# Altium schematic sheet 13_Clocks_1.SchDoc: Clocks 1
size A3; Organization: Lime Microsystems; Address1: Surrey Tech Centre; Address2: Guildford GU2 7YG; Address3: Surrey; Address4: United Kingdom; Revision: SoDeRa-PCI v1.0; SheetNumber: 13; SheetTotal: 15
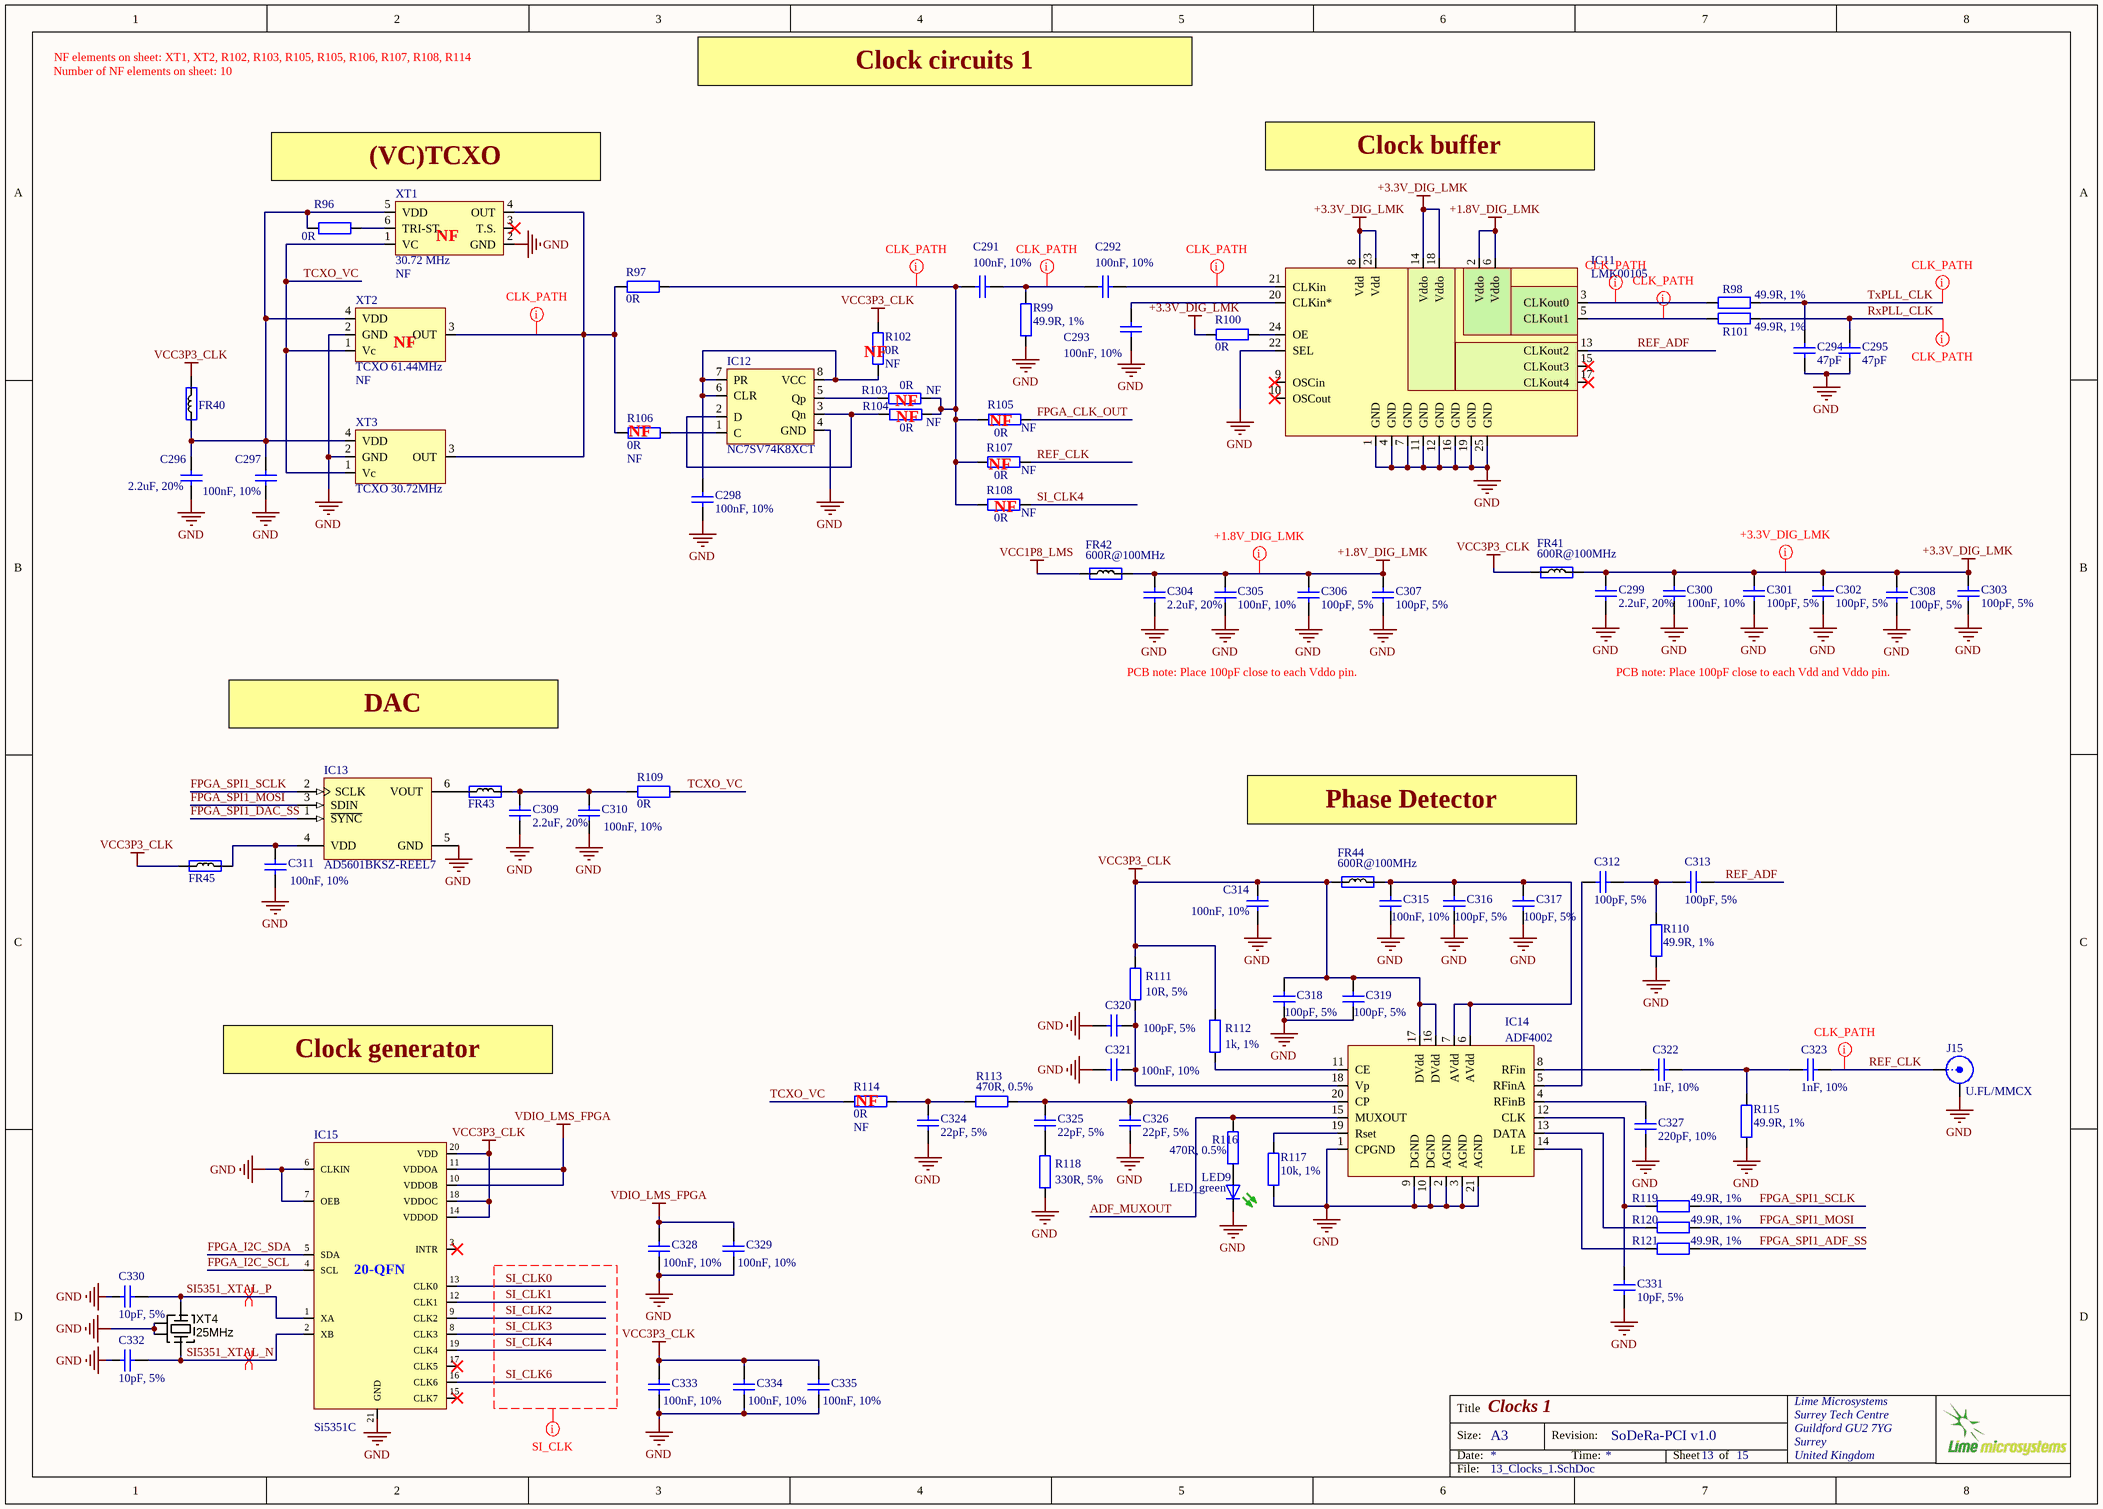
[diagram p0: 13_Clocks_1.SchDoc]

## Parts
C291  100nF, 10%  [CAP0402]
C292  100nF, 10%  [CAP0402]
C293  100nF, 10%  [CAP0402]
C294  47pF  [CAP0402]
C295  47pF  [CAP0402]
C296  2.2uF, 20%  [CAP0402]
C297  100nF, 10%  [CAP0402]
C298  100nF, 10%  [CAP0402]
C299  2.2uF, 20%  [CAP0402]
C300  100nF, 10%  [CAP0402]
C301  100pF, 5%  [CAP0402]
C302  100pF, 5%  [CAP0402]
C303  100pF, 5%  [CAP0402]
C304  2.2uF, 20%  [CAP0402]
C305  100nF, 10%  [CAP0402]
C306  100pF, 5%  [CAP0402]
C307  100pF, 5%  [CAP0402]
C308  100pF, 5%  [CAP0402]
C309  2.2uF, 20%  [CAP0402]
C310  100nF, 10%  [CAP0402]
C311  100nF, 10%  [CAP0402]
C312  100pF, 5%  [CAP0402]
C313  100pF, 5%  [CAP0402]
C314  100nF, 10%  [CAP0402]
C315  100nF, 10%  [CAP0402]
C316  100pF, 5%  [CAP0402]
C317  100pF, 5%  [CAP0402]
C318  100pF, 5%  [CAP0402]
C319  100pF, 5%  [CAP0402]
C320  100pF, 5%  [CAP0402]
C321  100nF, 10%  [CAP0402]
C322  1nF, 10%  [CAP0402]
C323  1nF, 10%  [CAP0402]
C324  22pF, 5%  [CAP0402]
C325  22pF, 5%  [CAP0402]
C326  22pF, 5%  [CAP0402]
C327  220pF, 10%  [CAP0402]
C328  100nF, 10%  [CAP0402]
C329  100nF, 10%  [CAP0402]
C330  10pF, 5%  [CAP0402]
C331  10pF, 5%  [CAP0402]
C332  10pF, 5%  [CAP0402]
C333  100nF, 10%  [CAP0402]
C334  100nF, 10%  [CAP0402]
C335  100nF, 10%  [CAP0402]
FR40  Ferrite  [RES0201]  (value not drawn)
FR41  600R@100MHz  [RES0805]
FR42  600R@100MHz  [RES0805]
FR43  Ferrite  [RES0201]  (value not drawn)
FR44  600R@100MHz  [RES0805]
FR45  Ferrite  [RES0201]  (value not drawn)
IC11  LMK00105  [LMK00105SQ]
IC12  NC7SV74K8XCT  [NC7SV74K8XCT]
IC13  AD5601BKSZ-REEL7  [AD5601_SOT23-6]
IC14  ADF4002  [ADF4002]
IC15  Si5351C  [Si5351C_20QFN]
J15  U.FL/MMCX  [MMCX_UFL_conn_u]
LED9  LED_green  [LED-0603-GREEN]
R96  0R  [RES0402]
R97  0R  [RES0402]
R98  49.9R, 1%  [RES0402]
R99  49.9R, 1%  [RES0402]
R100  0R  [RES0402]
R101  49.9R, 1%  [RES0402]
R102  0R  Assembly Info: NF  [RES0402]
R103  0R  Assembly Info: NF  [RES0402]
R104  0R  Assembly Info: NF  [RES0402]
R105  0R  Assembly Info: NF  [RES0402]
R106  0R  Assembly Info: NF  [RES0402]
R107  0R  Assembly Info: NF  [RES0402]
R108  0R  Assembly Info: NF  [RES0402]
R109  0R  [RES0402]
R110  49.9R, 1%  [RES0402]
R111  10R, 5%  [RES0402]
R112  1k, 1%  [RES0402]
R113  470R, 0.5%  [RES0402]
R114  0R  Assembly Info: NF  [RES0402]
R115  49.9R, 1%  [RES0402]
R116  470R, 0.5%  [RES0402]
R117  10k, 1%  [RES0402]
R118  330R, 5%  [RES0402]
R119  49.9R, 1%  [RES0402]
R120  49.9R, 1%  [RES0402]
R121  49.9R, 1%  [RES0402]
XT1  30.72 MHz  Assembly Info: NF  [RAKON_RPT7050A]
XT2  TCXO 61.44MHz  Assembly Info: NF  [RAKON_TXCO_61MHz_v2]
XT3  TCXO 30.72MHz  [RAKON_TXCO]
XT4  25MHz  [CRYSTAL_4-LCC]

## Nets
+1.8V_DIG_LMK: C304.2 C305.2 C306.2 C307.2 FR42.2 IC11.2(Vddo) IC11.6(Vddo)
+3.3V_DIG_LMK: C299.2 C300.2 C301.2 C302.2 C303.2 C308.2 FR41.2 IC11.8(Vdd) IC11.14(Vddo) IC11.18(Vddo) IC11.23(Vdd) R100.1
GND: C293.1 C294.1 C295.1 C296.1 C297.1 C298.1 C299.1 C300.1 C301.1 C302.1 C303.1 C304.1 C305.1 C306.1 C307.1 C308.1 C309.1 C310.2 C311.2 C314.1 C315.1 C316.2 C317.2 C318.2 C319.2 C320.1 C321.2 C324.1 C326.1 C327.2 C328.2 C329.2 C330.1 C331.1 C332.1 C333.2 C334.2 C335.2 IC11.1(GND) IC11.4(GND) IC11.7(GND) IC11.11(GND) IC11.12(GND) IC11.16(GND) IC11.19(GND) IC11.22(SEL) IC11.25(GND) IC12.4(GND) IC13.5(GND) IC14.1(CPGND) IC14.2(AGND) IC14.3(AGND) IC14.9(DGND) IC14.10(DGND) IC14.21(AGND) IC15.6(CLKIN) IC15.7(OEB) IC15.21(GND) J15.2(Y) LED9.K(C) R99.1 R110.1 R115.1 R117.2 R118.1 XT1.2(GND) XT2.2(GND) XT3.2(GND) XT4.2(GND) XT4.4(GND)
VCC1P8_LMS: FR42.1
VCC3P3_CLK: C314.2 C318.1 C319.1 C333.1 C334.1 C335.1 FR40.2 FR41.1 FR44.1 FR45.1 IC14.16(DVdd) IC14.17(DVdd) IC15.14(VDDOD) IC15.18(VDDOC) IC15.20(VDD) R102.1 R111.2 R112.2
VDIO_LMS_FPGA: C328.1 C329.1 IC15.10(VDDOB) IC15.11(VDDOA)
ADF_MUXOUT: IC14.15(MUXOUT) R116.2
FPGA_CLK_OUT: R105.1
FPGA_I2C_SCL: IC15.4(SCL)
FPGA_I2C_SDA: IC15.5(SDA)
FPGA_SPI1_ADF_SS: R121.1
FPGA_SPI1_DAC_SS: IC13.1(~{SYNC})
FPGA_SPI1_MOSI: IC13.3(SDIN) R120.1
FPGA_SPI1_SCLK: IC13.2(SCLK) R119.1
REF_ADF: C313.2 IC11.13(CLKout2)
REF_CLK: C323.1 J15.1(X) R107.2
RxPLL_CLK: C295.2 R101.1
SI5351_XTAL_N: C332.2 IC15.2(XB) XT4.3(X)
SI5351_XTAL_P: C330.2 IC15.1(XA) XT4.1(X)
SI_CLK0: IC15.13(CLK0)
SI_CLK1: IC15.12(CLK1)
SI_CLK2: IC15.9(CLK2)
SI_CLK3: IC15.8(CLK3)
SI_CLK4: IC15.19(CLK4) R108.2
SI_CLK6: IC15.16(CLK6)
TCXO_VC: R109.1 R114.2 XT1.1(VC) XT2.1(Vc) XT3.1(Vc)
TxPLL_CLK: C294.2 R98.1
NetC291_1: C291.1 C292.2 R99.2
NetC291_2: C291.2 R97.1 R103.1 R104.1 R105.2 R107.1 R108.1
NetC292_1: C292.1 IC11.21(CLKin)
NetC293_2: C293.2 IC11.20(CLKin*)
NetC296_2: C296.2 C297.2 FR40.1 R96.2 XT1.5(VDD) XT2.4(VDD) XT3.4(VDD)
NetC298_2: C298.2 IC12.6(CLR) IC12.7(PR) IC12.8(VCC) R102.2
NetC309_2: C309.2 C310.1 FR43.2 R109.2
NetC311_1: C311.1 FR45.2 IC13.4(VDD)
NetC312_1: C312.1 IC14.5(RFinA)
NetC312_2: C312.2 C313.1 R110.2
NetC315_2: C315.2 C316.1 C317.1 FR44.2 IC14.6(AVdd) IC14.7(AVdd)
NetC320_2: C320.2 C321.1 IC14.18(Vp) R111.1
NetC322_1: C322.1 C323.2 R115.2
NetC322_2: C322.2 IC14.8(RFin)
NetC324_2: C324.2 R113.2 R114.1
NetC325_1: C325.1 R118.2
NetC325_2: C325.2 C326.2 IC14.20(CP) R113.1
NetC327_1: C327.1 IC14.4(RFinB)
NetC331_2: C331.2 IC14.12(CLK) R119.2
NetFR43_1: FR43.1 IC13.6(VOUT)
NetIC11_3: IC11.3(CLKout0) R98.2
NetIC11_5: IC11.5(CLKout1) R101.2
NetIC11_24: IC11.24(OE) R100.2
NetIC12_1: IC12.1(C) R106.1
NetIC12_2: IC12.2(D) IC12.3(Qn) R104.2
NetIC12_5: IC12.5(Qp) R103.2
NetIC14_11: IC14.11(CE) R112.1
NetIC14_13: IC14.13(DATA) R120.2
NetIC14_14: IC14.14(LE) R121.2
NetIC14_19: IC14.19(Rset) R117.1
NetLED9_A: LED9.A R116.1
NetR96_1: R96.1 XT1.6(TRI-ST.)
NetR97_2: R97.2 R106.2 XT1.4(OUT) XT2.3(OUT) XT3.3(OUT)

Not connected (* = marked no-connect by the designer): IC11 9(OSCin)* 10(OSCout)* 15(CLKout3)* 17(CLKout4)*; IC15 3(INTR)* 15(CLK7)* 17(CLK5)*; XT1 3(T.S.)*

## Layout directives
net class CLK_PATH: NetC291_1, NetC291_2, NetC292_1, NetIC11_3, NetIC11_5, NetR97_2, REF_CLK, RxPLL_CLK, TxPLL_CLK
net class SI_CLK: SI_CLK0, SI_CLK1, SI_CLK2, SI_CLK3, SI_CLK4, SI_CLK6
differential pair: SI5351_XTAL_N, SI5351_XTAL_P
net class +1.8V_DIG_LMK: +1.8V_DIG_LMK
net class +3.3V_DIG_LMK: +3.3V_DIG_LMK

## Notes on the sheet
- Number of NF elements on sheet: 10
- NF elements on sheet: XT1, XT2, R102, R103, R105, R105, R106, R107, R108, R114
- Clock circuits 1
- (VC)TCXO
- Clock buffer
- (near XT1) NF
- (near XT2) NF
- (near R102) NF
- (near R106) NF
- NF
- (near R104) NF
- (near R105) NF
- (near R107) NF
- (near R108) NF
- PCB note: Place 100pF close to each Vddo pin.
- PCB note: Place 100pF close to each Vdd and Vddo pin.
- DAC
- Phase Detector
- Clock generator
- (near R114) NF
- Title
- Size:
- Date:
- A3
- Revision:
- Time:
- Sheet
- of
- File:
- (in symbol Si5351C) 20-QFN

## Library data of the parts
C291-C293 C297 C298 C300 C305 C314 C315 C321 = Cap_0402: Manufacturer: Murata Electronics; Manufacturer Part Number: GRM155R71C104KA88D; Voltage Rating DC: 16 V; Type: General Purpose MLCC; Capacitance: 0.1 uF; Case Length: 1 mm; Dielectric: X7R; Case Height: 0.5 mm; Temperature Coefficient / Code: +/- 15 %; Value: 100nF, 10%; Supplier 1: Mouser; Supplier Part Number 1: 81-GRM155R71C104KA88; Case Code - in: 0402; RoHS: RoHS Compliant; Operating Temperature Range: - 55 C to + 125 C; Series: GRM; Termination Style: SMD/SMT; Tolerance: 10 %; Package / Case: 0402 (1005 metric); Maximum Operating Temperature: + 125 C; Case Code - mm: 1005; Minimum Operating Temperature: - 55 C; Product Category: Low & Medium Capacitance SMD Ceramic Chip Capacitors; Packaging: Reel; Product: General Type MLCCs; Category: Multilayer Ceramic Capacitors MLCC - SMD/SMT; Brand: Murata Electronics; Case Width: 0.5 mm; RoHS - Mouser: Y; Standard Pack Qty: 10000; Minimum Order Quantity: 1; Reeling: True; Manufacturer Part Number 1: GRM155R71C104KA88D
C294 C295 = Cap_0402: Manufacturer Part Number 1: C1005C0G1H470F050BA; Manufacturer: TDK Corporation; Voltage - Rated: 50V; Temperature Coefficient: C0G, NP0; Tolerance: ±1%; Value: 47pF; Supplier 1: Digi-Key; Supplier Part Number 1: 445-5361-1-ND; Package / Case: 0402 (1005 Metric); Lead Spacing: -; Ratings: -; Mounting Type: Surface Mount, MLCC; Operating Temperature: -55°C ~ 125°C; Thickness (Max): 0.022" (0.55mm); Capacitance: 47pF; Packaging: Cut Tape (CT); Features: -; Applications: General Purpose; Lead Style: -; Size / Dimension: 0.039" L x 0.020" W (1.00mm x 0.50mm); Height - Seated (Max): -; RoHS: RoHS Compliant; Category: Capacitors
C296 C299 C304 C309 = Cap_0402: Manufacturer Part Number 1: C1005X5R1C225K050BC; Manufacturer: TDK Corporation; Voltage - Rated: 16V; Temperature Coefficient: X5R; Capacitance: 2.2µF; Value: 2.2uF, 20%; Supplier 1: Digi-Key; Supplier Part Number 1: 445-9085-1-ND; Category: Capacitors; Thickness (Max): 0.022" (0.55mm); Applications: General Purpose; Package / Case: 0402 (1005 Metric); Size / Dimension: 0.039" L x 0.020" W (1.00mm x 0.50mm); Features: -; Mounting Type: Surface Mount, MLCC; Ratings: -; Lead Style: -; Operating Temperature: -55°C ~ 85°C; Lead Spacing: -; RoHS: RoHS Compliant; Height - Seated (Max): -; Tolerance: ±20%; Packaging: Tape & Reel (TR)
C301-C303 C306-C308 = Cap_0402: Manufacturer Part Number 1: CC0402JRNPO9BN101; Manufacturer: Yageo; Voltage - Rated: 50V; Temperature Coefficient: C0G, NP0; Value: 100pF, 5%; Supplier 1: Digi-Key; Supplier Part Number 1: 311-1024-1-ND; RoHS: RoHS Compliant; Category: Capacitors; Applications: General Purpose; Mounting Type: Surface Mount, MLCC; Capacitance: 100pF; Ratings: -; Packaging: Cut Tape (CT); Size / Dimension: 0.039" L x 0.020" W (1.00mm x 0.50mm); Height - Seated (Max): -; Package / Case: 0402 (1005 Metric); Operating Temperature: -55°C ~ 125°C; Features: -; Tolerance: ±5%; Lead Spacing: -; Lead Style: -; Thickness (Max): 0.022" (0.55mm)
C310 C311 C328 C329 C333-C335 = Cap_0603: Manufacturer: Murata; Manufacturer Part Number 1: GRM155R71C104KA88D; Brand: Murata Electronics; Type: General Purpose MLCC; Capacitance: 0.1 uF; Temperature Coefficient / Code: +/- 15 %; Voltage Rating DC: 16 V; Supplier 1: Mouser; Supplier Part Number 1: 81-GRM155R71C104KA88; Tolerance: 10 %; Case Code - in: 0402; Category: Multilayer Ceramic Capacitors MLCC - SMD/SMT; Value: 100nF, 10%; Manufacturer Part Number: GRM155R71C104KA88D
C312 C313 C316-C320 = Cap_0402: Manufacturer: Yageo; Manufacturer Part Number 1: CC0402JRNPO9BN101; Voltage - Rated: 50V; Temperature Coefficient: C0G, NP0; Value: 100pF, 5%; Supplier 1: Digi-Key; Supplier Part Number 1: 311-1024-1-ND; Category: Capacitors; Features: -; Operating Temperature: -55°C ~ 125°C; Capacitance: 100pF; Thickness (Max): 0.022" (0.55mm); RoHS: RoHS Compliant; Lead Style: -; Ratings: -; Size / Dimension: 0.039" L x 0.020" W (1.00mm x 0.50mm); Height - Seated (Max): -; Applications: General Purpose; Package / Case: 0402 (1005 Metric); Lead Spacing: -; Packaging: Tape & Reel (TR); Mounting Type: Surface Mount, MLCC; Tolerance: ±5%
C322 C323 = Cap_0402: Manufacturer Part Number 1: GCM155R71H102KA37D; Capacitance: 1000 pF; Type: Automotive Ultra Small MLCC; Brand: Murata Electronics; Case Height: 0.5 mm; Case Length: 1 mm; Dielectric: X7R; Voltage Rating DC: 50 V; Temperature Coefficient / Code: +/- 15 %; Value: 1nF, 10%; Supplier 1: Mouser; Supplier Part Number 1: 81-GCM155R71H102KA7D; Case Code - in: 0402; Package / Case: 0402 (1005 metric); Tolerance: 10 %; Termination Style: SMD/SMT; Packaging: Reel; Operating Temperature Range: - 55 C to + 125 C; Maximum Operating Temperature: + 125 C; Manufacturer: Murata Electronics; Category: Multilayer Ceramic Capacitors MLCC - SMD/SMT; RoHS: RoHS Compliant; Series: GCM; Case Width: 0.5 mm; Case Code - mm: 1005; Product: Automotive MLCCs; Standard Pack Qty: 10000; Reeling: True; RoHS - Mouser: Y; Minimum Order Quantity: 1; Product Category: Automotive Ceramic Chip Capacitors; Minimum Operating Temperature: - 55 C
C324-C326 = Cap_0402: Manufacturer: Yageo; Manufacturer Part Number 1: CC0402JRNPO9BN220; Voltage - Rated: 50V; Temperature Coefficient: C0G, NP0; Value: 22pF, 5%; Supplier 1: Digi-Key; Supplier Part Number 1: 311-1018-2-ND; Tolerance: ±5%; Category: Capacitors; Packaging: Tape & Reel (TR); RoHS: RoHS Compliant; Capacitance: 22pF; Operating Temperature: -55°C ~ 125°C; Mounting Type: Surface Mount, MLCC; Height - Seated (Max): -; Size / Dimension: 0.039" L x 0.020" W (1.00mm x 0.50mm); Ratings: -; Applications: General Purpose; Thickness (Max): 0.022" (0.55mm); Lead Spacing: -; Lead Style: -; Features: -; Package / Case: 0402 (1005 Metric)
C327 = Cap_0402: Manufacturer Part Number 1: CC0402KRX7R9BB221; Manufacturer: Yageo; Temperature Coefficient: X7R; Voltage - Rated: 50V; Value: 220pF, 10%; Supplier 1: Digi-Key; Supplier Part Number 1: 311-1035-2-ND; Category: Capacitors; Ratings: -; RoHS: RoHS Compliant; Packaging: Tape & Reel (TR); Mounting Type: Surface Mount, MLCC; Applications: General Purpose; Capacitance: 220pF; Tolerance: ±10%; Operating Temperature: -55°C ~ 125°C; Package / Case: 0402 (1005 Metric); Lead Spacing: -; Size / Dimension: 0.039" L x 0.020" W (1.00mm x 0.50mm); Thickness (Max): 0.022" (0.55mm); Height - Seated (Max): -; Lead Style: -; Features: -
C330 C332 = Cap_0402: Manufacturer: AVX; Capacitance: 10; Ceramic Capacitor Case: 0402 [1005 Metric]; Supplier 1: Farnell; Supplier Part Number 1: 2332478RL; Capacitance Tolerance: ± 5%; value: 10pF, 5%
C331 = Cap_0402: Manufacturer Part Number 1: 04023A100JAT2A; Manufacturer: AVX; Voltage Rating: 25; Ceramic Capacitor Case: 0402 [1005 Metric]; Capacitor Case Style: 0402 [1005 Metric]<!--FANDB--><div class="features-and-benefits-container"></div>; Dielectric Characteristic: C0G / NP0; SVHC: No SVHC (16-Jun-2014); Capacitance: 10; Value: 10pF, 5%; Supplier 1: Farnell; Supplier Part Number 1: 2332478RL; Capacitance Tolerance: ± 5%; Product Range: -; RoHS: YES; Operating Temperature Min: -55; Operating Temperature Max: 125; Capacitance Tolerance ±: ± 5%; MSL: MSL 1 - Unlimited; Packaging: Cut Tape
FR40 FR43 FR45 = Ferrite: Manufacturer Part Number 1: BK0603TS601-T; Manufacturer: Taiyo Yuden; DC Resistance (DCR): 750 mOhm Max; Filter Type: Differential Mode - Single; Impedance @ Frequency: 600 Ohm @ 100MHz; Current Rating: 270mA; Value: 600R@100MHz; Supplier 1: Digi-Key; Supplier Part Number 1: 587-3277-1-ND; Size / Dimension: 0.024" L x 0.012" W (0.60mm x 0.30mm); Package / Case: 0201 (0603 Metric); Height (Max): 0.013" (0.33mm); Mounting Type: Surface Mount; Packaging: Cut Tape (CT); RoHS: RoHS Compliant; Category: Filters
FR41 FR42 FR44 = Ferrite: Manufacturer Part Number 1: MPZ2012S601AT000; Manufacturer: TDK Corporation; Filter Type: Differential Mode - Single; Impedance @ Frequency: 600 Ohm @ 100MHz; DC Resistance (DCR): 100 mOhm Max; Current Rating: 2A; Supplier 1: Digi-Key; Supplier Part Number 1: 445-2206-2-ND; Mounting Type: Surface Mount; RoHS: RoHS Compliant; Height (Max): 0.041" (1.05mm); Packaging: Tape & Reel (TR); Category: Filters; Package / Case: 0805 (2012 Metric); Size / Dimension: 0.079" L x 0.049" W (2.00mm x 1.25mm)
IC11 = LMK00105: Manufacturer: Texas Instruments; Manufacturer Part Number 1: LMK00105SQ/NOPB; Frequency - Max: 200MHz; Voltage - Supply: 2.375 V ~ 3.45 V; Input: HCSL, LVCMOS, LVDS, LVPECL, LVTTL, SSTL, Crystal; Differential - Input:Output: Yes/No; Supplier 1: Digi-Key; Type: Fanout Buffer (Distribution), Multiplexer, Translator; Category: Integrated Circuits (ICs); Operating Temperature: -40°C ~ 85°C; Package / Case: 24-WFQFN Exposed Pad; Supplier Device Package: 24-WQFN (4x4); Supplier Part Number 1: LMK00105SQ/NOPBCT-ND
IC12 = NC7SV74K8XCT: Manufacturer: Fairchild Semiconductor; Max Propagation Delay @ V, Max CL: 2.8ns @ 3.3V, 30pF; Frequency - Clock: 200MHz; Current - Output High, Low: 24mA, 24mA; Current - Quiescent: 0.9µA; Number of Bits per Element: 1; Trigger Type: Positive Edge; Output Type: Differential; Function: Set(Preset) and Reset; Input Capacitance: 2pF; Voltage - Supply: 0.9 V ~ 3.6 V; Supplier 1: Digi-Key; Operating Temperature: -40°C ~ 85°C (TA); Mounting Type: Surface Mount; Package / Case: 8-VFSOP (0.091", 2.30mm Width); Packaging: Cut Tape (CT); Number of Elements: 1; Manufacturer Part Number 1: NC7SV74K8X; RoHS: RoHS Compliant; Type: D-Type; Category: Integrated Circuits (ICs); Supplier Part Number 1: NC7SV74K8XCT-ND
IC13 = AD5601BKSZ-REEL7: Single 8-Bit nanoDAC with SPI Interface in LFCSP and SC70, 2.7 to 5.5 V, <100 uA, -40 to +125 degC, KS-6, Pb-Free, Reel; Generic Part Number: AD5601; Manufacturer: Analog Devices; # DAC Outputs: 1; Max V+: 5.5V; Op Pwr Diss: 550µW; Resolution (Bits): 8; Settling Time: 6µs; Single Supply: Yes; DatasheetVersion: Rev.F; PackageVersion: 072809-A; PackageReference: KS-6; PackageDescription: 6-Lead Thin Shrink Small Outline Transistor Package [SC70]; Supplier 1: Digi-Key; Supplier Part Number 1: AD5601BKSZ-REEL7TR-ND; Supplier 2: Digi-Key; Supplier Part Number 2: AD5601BKSZ-REEL7CT-ND; Supplier 3: Digi-Key; Supplier Part Number 3: AD5601BKSZ-REEL7DKR-ND; Supplier 4: Farnell; Supplier Part Number 4: 2312971; Supplier 5: Newark; Supplier Part Number 5: 59K4256; Supplier 6: Newark; Supplier Part Number 6: 67W3160; Supplier 7: Mouser; Supplier Part Number 7: 584-AD5601BKSZ-R7; Packing: Reel; RoHS: Y; Mounting Technology: Surface Mount; Code_JEDEC: MO-203-AB; PartNumber: AD5601BKSZ-REEL7; ComponentLink1Description: Manufacturer URL; ComponentLink1URL: http://www.analog.com/en/index.html; ComponentLink2Description: Datasheet; ComponentLink2URL: http://www.analog.com/static/imported-files/data_sheets/AD5601_5611_5621.pdf; ComponentLink3Description: Package Specification; ComponentLink3URL: http://www.analog.com/static/imported-files/packages/PKG_PDF/SC70(KS)/KS_6.pdf; ComponentLink4Description: Product URL; ComponentLink4URL: http://www.analog.com/en/digital-to-analog-converters/da-converters/ad5601/products/product.html
IC14 = ADF4002: Manufacturer: Analog Devices Inc; Manufacturer Part Number 1: ADF4002BCPZ-RL7; Ratio - Input:Output: 2:1; Differential - Input:Output: Yes/No; Input: CMOS, TTL; Voltage - Supply: 2.7 V ~ 3.3 V; Supplier 1: Digi-Key; Supplier: Digi-Key; Category: Integrated Circuits (ICs); Type: Clock/Frequency Synthesizer (RF), Phase Detector; Operating Temperature: -40°C ~ 85°C; Mounting Type: Surface Mount; Package / Case: 20-VFQFN Exposed Pad, CSP; Supplier Part Number 1: ADF4002BCPZ-RL7CT-ND
IC15 = Si5351C: Manufacturer Part Number 1: SI5351C-B-GM; Manufacturer: Silicon Labs; PLL: Yes; Input: Clock, Crystal; Output: LVCMOS; Number of Circuits: 1; Ratio - Input:Output: 2:8; Differential - Input:Output: No/No; Frequency - Max: 160MHz; Divider/Multiplier: Yes/No; Voltage - Supply: 1.71 V ~ 3.6 V; Supplier 1: Digi-Key; Supplier Part Number 1: 336-2402-5-ND; Category: Integrated Circuits (ICs); RoHS: RoHS Compliant; Packaging: Tube; Type: Clock Generator; Operating Temperature: -40°C ~ 85°C; Mounting Type: Surface Mount; Package / Case: 20-VFQFN Exposed Pad; Supplier Device Package: 20-QFN (4x4)
J15 = RF_IF_connector: Manufacturer: Molex, LLC; Manufacturer Part Number 1: 0734120110; Shield Termination: Solder; Frequency - Max: 6GHz; Impedance: 50 Ohm; Center Contact Material: Brass; Connector Style: Ultra Miniature Coaxial; Connector Type: Jack, Male Pin; Dielectric Material: Liquid Crystal Polymer (LCP); Center Contact Plating: Gold; Body Finish: Nickel; Body Material: Phosphor Bronze; Voltage Rating: 60V; Supplier 1: Digi-Key; Supplier Part Number 1: WM5587CT-ND; Ingress Protection: -; Category: Connectors, Interconnects; Mounting Type: Surface Mount; Packaging: Cut Tape (CT); Operating Temperature: -40°C ~ 90°C; Housing Color: Silver; Features: -; RoHS: RoHS Compliant; Cable Group: -; Fastening Type: Snap-On; Contact Termination: Solder
LED9 = LED_green: Current - Test: 20mA; Voltage - Forward (Vf) (Typ): 2.2V; Color: Green; Supplier 1: Digi-Key; Supplier Part Number 1: 516-1425-2-ND; Category: Optoelectronics; Package / Case: 0603 (1608 Metric)
R96 R97 R100 R102-R109 R114 = Res_0402: Manufacturer Part Number 1: RC0402JR-070RL; Manufacturer: Yageo; Resistance (Ohms): 0.0; Tolerance: Jumper; Power (Watts): 0.063W, 1/16W; Value: 0R; Supplier 1: Digi-Key; Supplier Part Number 1: 311-0.0JRTR-ND; Category: Resistors; Temperature Coefficient: -; Features: Moisture Resistant; Supplier Device Package: 0402; Height: 0.016" (0.40mm); Package / Case: 0402 (1005 Metric); Operating Temperature: -55°C ~ 155°C; Size / Dimension: 0.039" L x 0.020" W (1.00mm x 0.50mm); Composition: Thick Film; Packaging: Tape & Reel (TR); Number of Terminations: 2; RoHS: RoHS Compliant
R98 R99 R101 R110 R115 R119-R121 = Res_0402: Manufacturer: Samsung Electro-Mechanics America, Inc.; Manufacturer Part Number: RC1005F49R9CS; Temperature Coefficient: ±100ppm/°C; Resistance (Ohms): 49.9; Power (Watts): 0.063W, 1/16W; Number of Terminations: 2; Size / Dimension: 0.039" L x 0.020" W (1.00mm x 0.50mm); Supplier Device Package: 0402 (1005 Metric); RoHS: RoHS Compliant; Supplier Part Number 1: 1276-3469-6-ND; Features: -; Packaging: Digi-Reel®; Tolerance: ±1%; Height: 0.016" (0.40mm); Category: Resistors; Composition: Thick Film; Package / Case: 0402 (1005 Metric); Supplier 1: Digi-Key; Operating Temperature: -55°C ~ 155°C; Value: 49.9R, 1%
R111 = Res_0402: Manufacturer Part Number 1: RC0402JR-0710RL; Manufacturer: Yageo; Power (Watts): 0.063W, 1/16W; Resistance (Ohms): 10; Temperature Coefficient: ±200ppm/°C; Value: 10R, 5%; Supplier 1: Digi-Key; Supplier Part Number 1: 311-10JRTR-ND; Number of Terminations: 2; Height: 0.016" (0.40mm); RoHS: RoHS Compliant; Composition: Thick Film; Packaging: Tape & Reel (TR); Category: Resistors; Supplier Device Package: 0402; Features: Moisture Resistant; Tolerance: ±5%; Operating Temperature: -55°C ~ 155°C; Size / Dimension: 0.039" L x 0.020" W (1.00mm x 0.50mm); Package / Case: 0402 (1005 Metric)
R112 = Res_0402: Manufacturer: Stackpole Electronics Inc; Manufacturer Part Number 1: RMCF0402FT1K00; Temperature Coefficient: ±100ppm/°C; Power (Watts): 0.063W, 1/16W; Value: 1k, 1%; Supplier 1: Digi-Key; Supplier Part Number 1: RMCF0402FT1K00TR-ND; Resistance (Ohms): 1k; Packaging: Tape & Reel (TR); Category: Resistors; RoHS: RoHS Compliant; Tolerance: ±1%; Height: 0.016" (0.40mm); Number of Terminations: 2; Package / Case: 0402 (1005 Metric); Operating Temperature: -55°C ~ 155°C; Features: -; Composition: Thick Film; Supplier Device Package: 0402; Size / Dimension: 0.039" L x 0.020" W (1.00mm x 0.50mm)
R113 = Res_0402: Manufacturer: Panasonic Electronic Components; Manufacturer Part Number 1: ERA-2AED471X; Power (Watts): 0.063W, 1/16W; Temperature Coefficient: ±25ppm/°C; Resistance (Ohms): 470; Value: 470R, 0.5%; Supplier 1: Digi-Key; Supplier Part Number 1: P470DETR-ND; Tolerance: ±0.5%; Packaging: Tape & Reel (TR); Number of Terminations: 2; Operating Temperature: -55°C ~ 155°C; RoHS: RoHS Compliant; Size / Dimension: 0.039" L x 0.020" W (1.00mm x 0.50mm); Composition: Thin Film; Package / Case: 0402 (1005 Metric); Height: 0.016" (0.40mm); Features: Automotive AEC-Q200; Supplier Device Package: 0402; Category: Resistors
R116 = Res_0402: Temperature Coefficient: ±25ppm/°C; Supplier 1: Digi-Key; Supplier Part Number 1: P470DETR-ND; Category: Resistors; Number of Terminations: 2; Composition: Thin Film; Tolerance: ±0.5%; value: 470R, 0.5%
R117 = Res_0402: Manufacturer: Yageo; Manufacturer Part Number 1: RC0402FR-0710KL; Temperature Coefficient: ±100ppm/°C; Power (Watts): 0.063W, 1/16W; Value: 10k, 1%; Supplier 1: Digi-Key; Supplier Part Number 1: 311-10.0KLRTR-ND; Resistance (Ohms): 10k; Packaging: Tape & Reel (TR); RoHS: RoHS Compliant; Package / Case: 0402 (1005 Metric); Tolerance: ±1%; Operating Temperature: -55°C ~ 155°C; Size / Dimension: 0.039" L x 0.020" W (1.00mm x 0.50mm); Number of Terminations: 2; Category: Resistors; Height: 0.016" (0.40mm); Supplier Device Package: 0402; Features: Moisture Resistant; Composition: Thick Film
R118 = Res_0402: Manufacturer: Yageo; Manufacturer Part Number 1: RC0402JR-07330RL; Power (Watts): 0.063W, 1/16W; Resistance (Ohms): 330; Temperature Coefficient: ±100ppm/°C; Value: 330R, 5%; Supplier 1: Digi-Key; Supplier Part Number 1: 311-330JRTR-ND; Composition: Thick Film; Supplier Device Package: 0402; Package / Case: 0402 (1005 Metric); Size / Dimension: 0.039" L x 0.020" W (1.00mm x 0.50mm); Features: Moisture Resistant; Height: 0.016" (0.40mm); Packaging: Tape & Reel (TR); RoHS: RoHS Compliant; Tolerance: ±5%; Category: Resistors; Number of Terminations: 2; Operating Temperature: -55°C ~ 155°C
XT1 = RPT7050A: Manufacturer Part Number 1: E6245LF; Supplier 1: Rakon; Supplier Part Number 1: E6245LF
XT2 = TXCO: Manufacturer Part Number 1: E5405LF; Supplier Part Number 1: E5405LF; Supplier 1: Rakon
XT3 = TXCO: Manufacturer Part Number 1: E5280LF; Supplier 1: Rakon; Supplier Part Number 1: E5280LF
XT4 = CRYSTAL_19M2: Oscillator Crystal 25 MHz; Manufacturer Part Number 1: ABM8-25.000MHZ-B2-T; Manufacturer: ABRACON; Supplier 1: Newark; Supplier Part Number 1: 13J1767